# Altium schematic sheet 4bandequi.SchDoc: 4-Band Equilizer
size A4; Organization: UiT; Address1: Bjørn Jonas; Address2: Lodve Langes gt. 2; Address3: 8514 Narvik; Address4: Norge; DocumentNumber: 1; Revision: a; SheetNumber: 1; SheetTotal: 3; SPICEModelCacheATUXSGBO: <root> / <DocumentId>ATUXSGBO</DocumentId> / <CacheFrame Number="0"> / <Model Name="trans" Kind="CKT"> / <Text>*Generic Transformer / *dw: 2-8-99 corrected VISRC polarity and FCTRL configuration / *Connections: / *             Pri+ / *             | Pri- / *             | | Sec+ / *             | | | Sec- / *             | | | | / .SUBCKT TRANS 1 2 3 4 PARAMS: RATIO=1 RP=0.1 RS=0.1 LEAK=1u MAG=1k / VISRC   4 9 0V / FCTRL   5 2 VISRC {RATIO} / EVCVS   8 9 5 2 {RATIO} / RPRI    1 7 {RP} / RSEC    8 3 {RS} / LLEAK   7 5 {LEAK} / LMAGNET 2 5 {MAG} / .ENDS TRANS</Text> / </Model> / </CacheFrame> / </root>
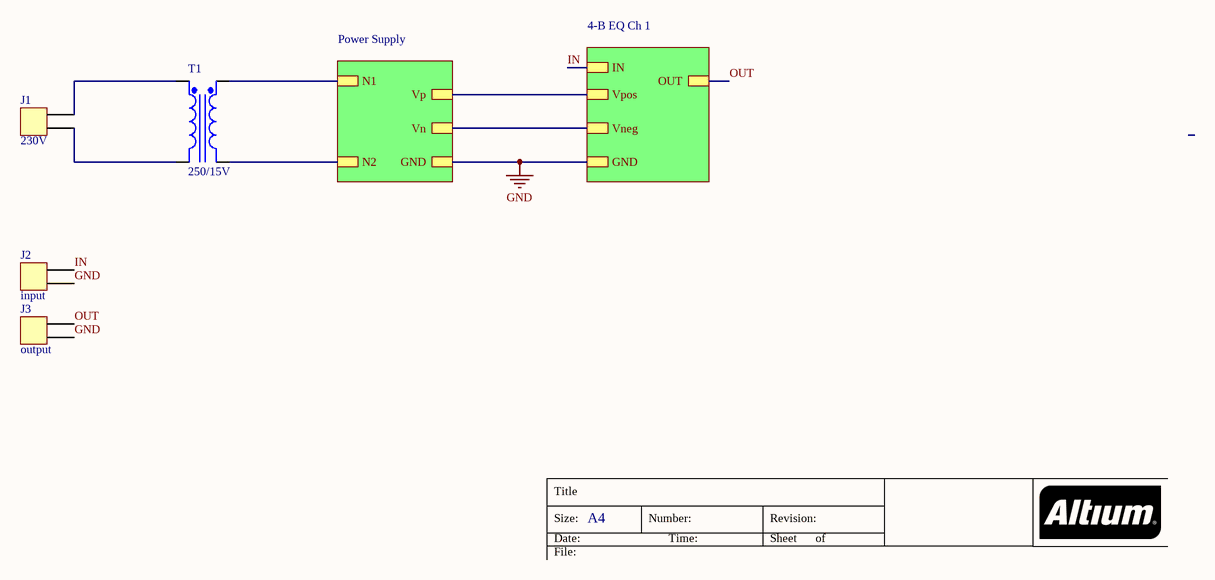
[diagram p0: 4bandequi.SchDoc]

## Parts
J1  230V  [Header 2]
J2  input  [150mil header]
J3  output  [150mil header]
T1  250/15V  [trans]

## Sub-sheets
4-B EQ Ch 1 = channel 1: IN, Vpos, Vneg, GND, OUT
Power Supply = Power supply: N1, N2, Vp, GND, Vn

## Nets
GND: J2.2 J3.2 ; sheet Power Supply/GND, sheet 4-B EQ Ch 1/GND
IN: J2.1 ; sheet 4-B EQ Ch 1/IN
OUT: J3.1 ; sheet 4-B EQ Ch 1/OUT
NetJ1_1: J1.1 T1.1(Pri+)
NetJ1_2: J1.2 T1.2(Pri-)
NetT1_3: T1.3(Sec+) ; sheet Power Supply/N1
NetT1_4: T1.4(Sec-) ; sheet Power Supply/N2
(unnamed): sheet Power Supply/Vp, sheet 4-B EQ Ch 1/Vpos
(unnamed): sheet Power Supply/Vn, sheet 4-B EQ Ch 1/Vneg

## Notes on the sheet
- Title
- Size:
- Date:
- A4
- Number:
- Time:
- Revision:
- Sheet
- of
- File:

## Library data of the parts
J1-J3 = Header_2
T1 = Trans Eq: Transformer (Equivalent Circuit Model); Published: 8-Jun-2000; LatestRevisionDate: 17-Jul-2002; LatestRevisionNote: Re-released for DXP Platform.; PackageReference: TRF_4; Publisher: Altium Limited; PackageDescription: Transformer; 4 Leads